# Altium schematic sheet HF_Amp.SchDoc
size 420 x 297 mm; Date: 28.01.2023; ApprovedBy: UA3REO; CheckedBy: UA3REO; Author: RU4PN; CompanyName: Wolf Team; DrawnBy: UA3REO; DocumentNumber: Wolf2 - HF Amp - Amp; SheetNumber: 2; SheetTotal: 3
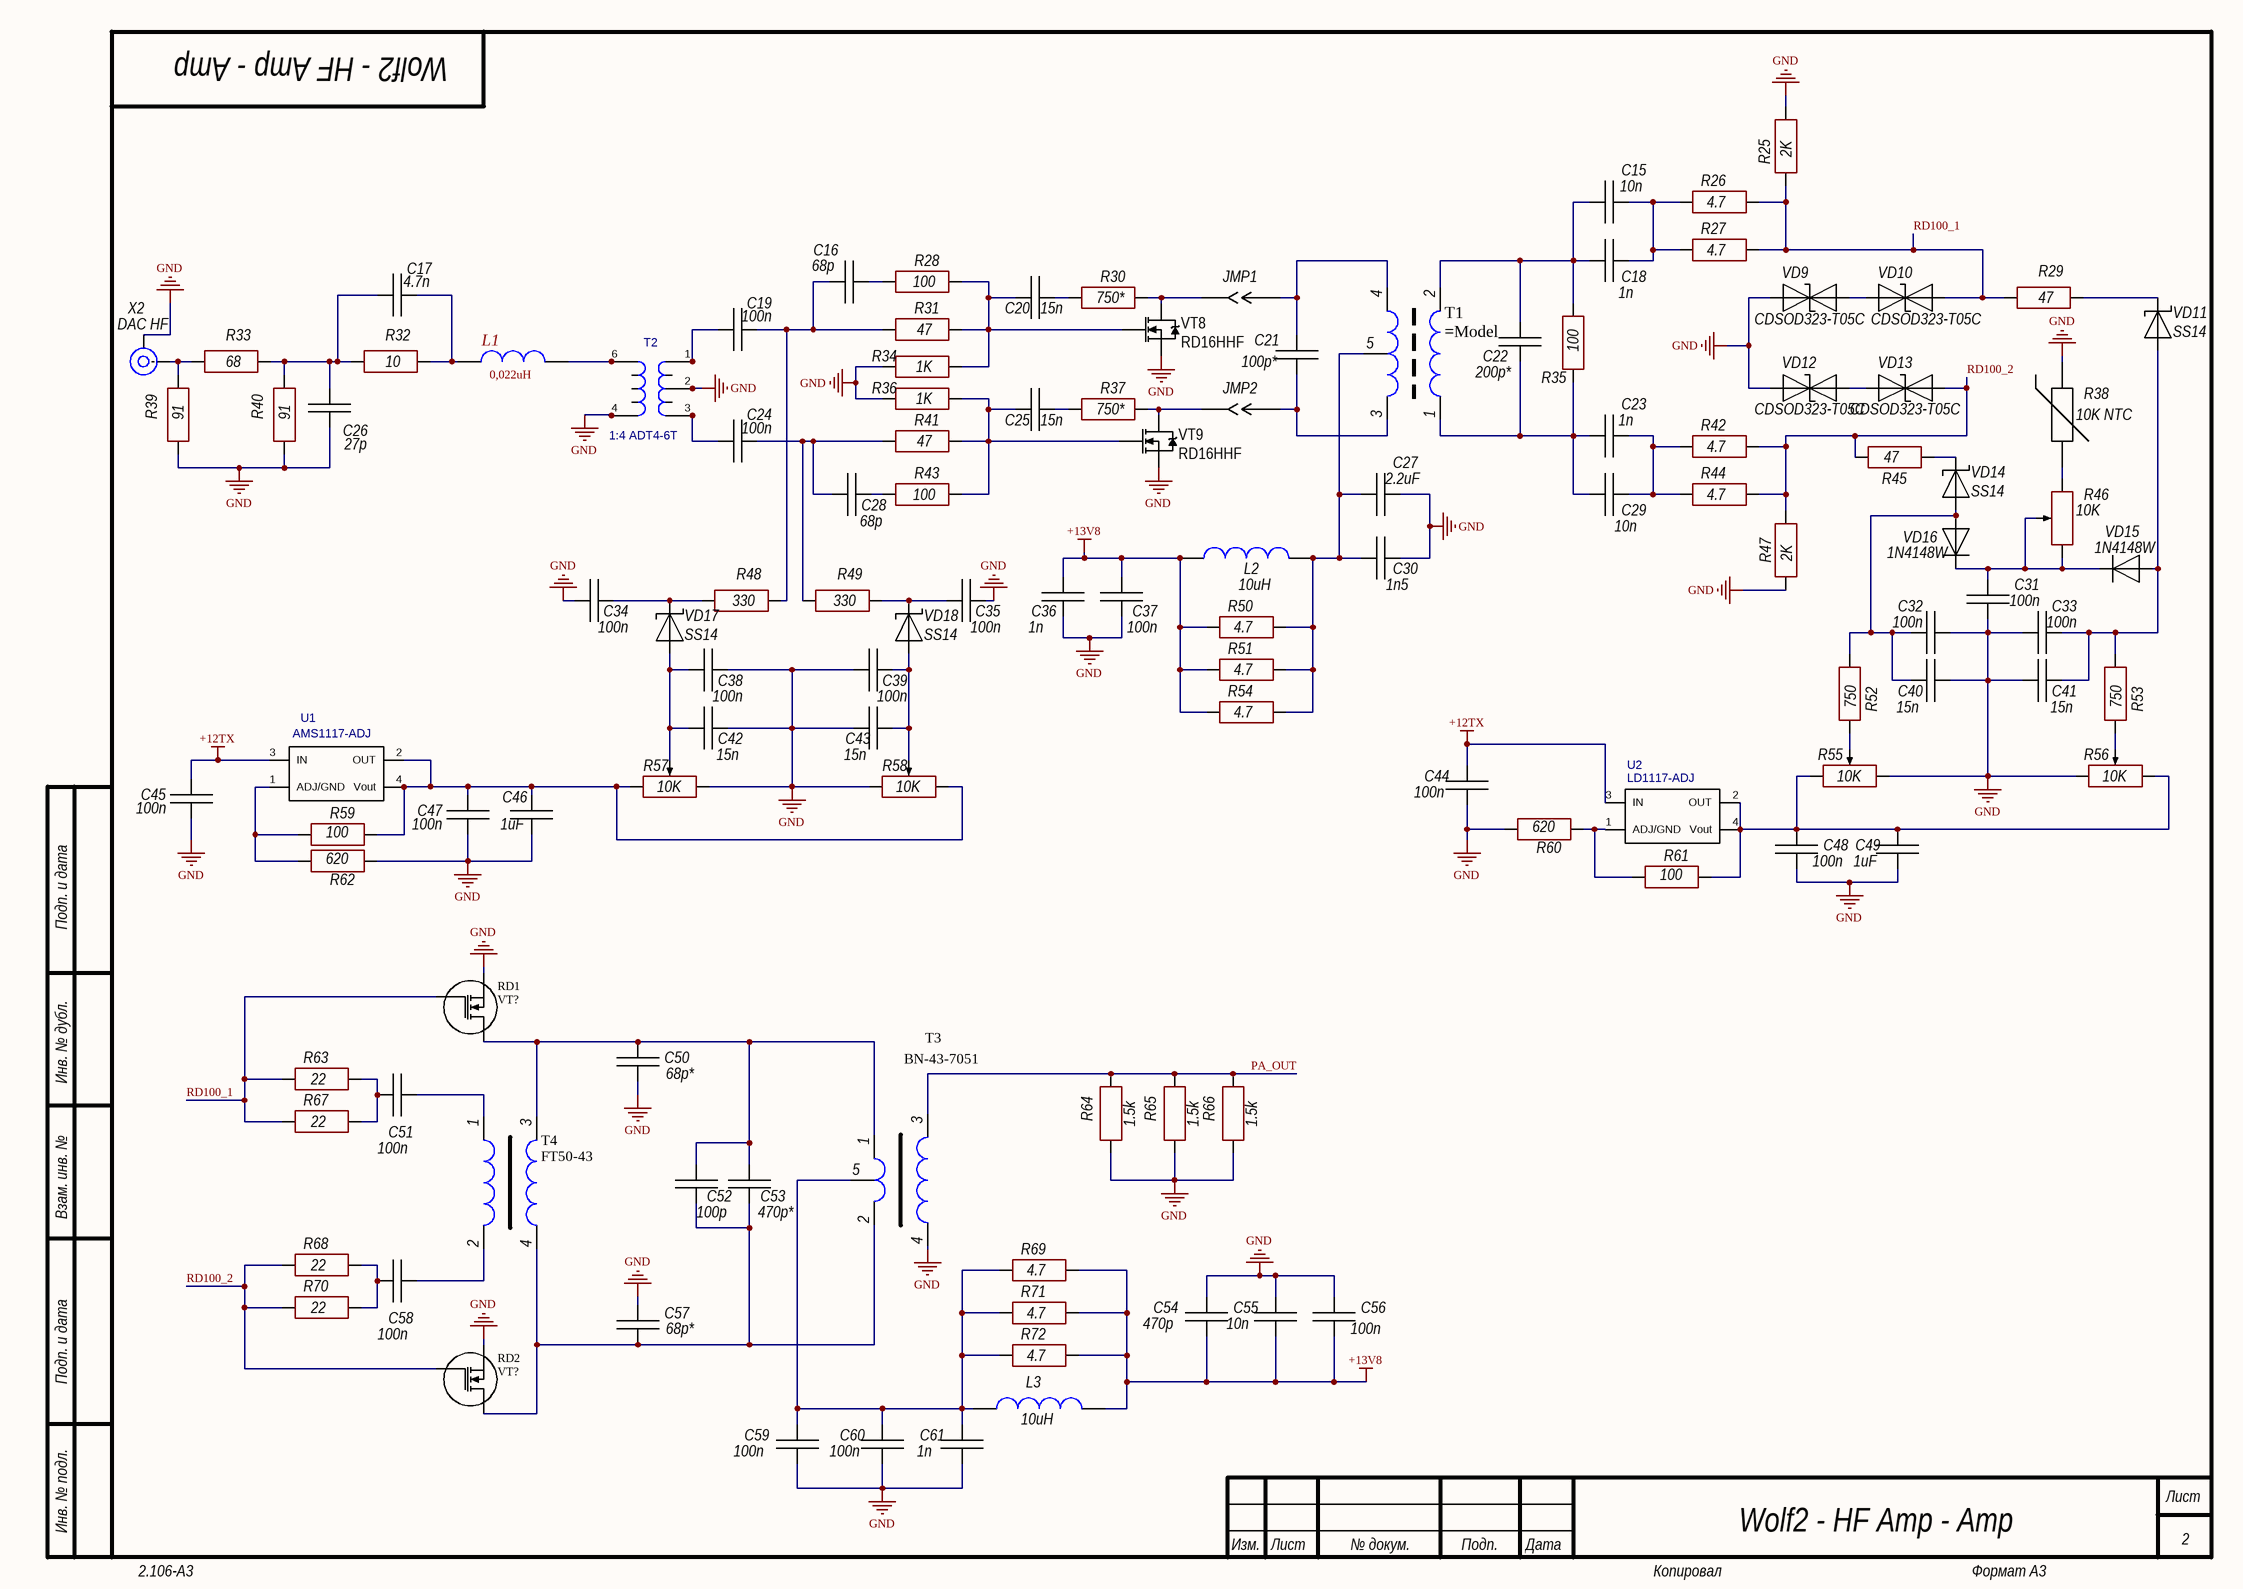
[diagram p0: HF_Amp.SchDoc]

## Parts
C15  10n  [CH1210C]
C16  68p  [CH0805C]
C17  4.7n  [CH0805C]
C18  1n  [CH1210C]
C19  100n  [CH0805C]
C20  15n  [CH1206C]
C21  100p*  [CH1210C]
C22  200p*  [CH1812C]
C23  1n  [CH1210C]
C24  100n  [CH0805C]
C25  15n  [CH1206C]
C26  27p  [CH0805C]
C27  2.2uF  [CH1206C]
C28  68p  [CH0805C]
C29  10n  [CH1210C]
C30  1n5  [CH1206C]
C31  100n  [CH0805C]
C32  100n  [CH0805C]
C33  100n  [CH0805C]
C34  100n  [CH0805C]
C35  100n  [CH0805C]
C36  1n  [CH0805C]
C37  100n  [CH0805C]
C38  100n  [CH0805C]
C39  100n  [CH0805C]
C40  15n  [CH0805C]
C41  15n  [CH0805C]
C42  15n  [CH0805C]
C43  15n  [CH0805C]
C44  100n  [CH0805C]
C45  100n  [CH0805C]
C46  1uF  [CH0805C]
C47  100n  [CH0805C]
C48  100n  [CH0805C]
C49  1uF  [CH0805C]
C50  68p*  [CH1206ATC]
C51  100n  [CH1210C]
C52  100p  [CH1812C]
C53  470p*  [CH1812C]
C54  470p  [CH1206C]
C55  10n  [CH1206C]
C56  100n  [CH1206C]
C57  68p*  [CH1206ATC]
C58  100n  [CH1210C]
C59  100n  [CH1206C]
C60  100n  [CH1206C]
C61  1n  [CH1206C]
JMP1  Jumper_2  [CON: JUMPER_2]  (value not drawn)
JMP2  Jumper_2  [CON: JUMPER_2]  (value not drawn)
L1  0,022uH  [CH1210L]
L2  10uH  [IND: R24]
L3  10uH  [IND: R24]
R25  2K  [CH2512R]
R26  4.7  [CH2512R]
R27  4.7  [CH2512R]
R28  100  [CH0805R]
R29  47  [CH0805R]
R30  750*  [CH1206R]
R31  47  [CH0805R]
R32  10  [CH0805R]
R33  68  [CH0805R]
R34  1K  [CH0805R]
R35  100  [CH2512R]
R36  1K  [CH0805R]
R37  750*  [CH1206R]
R38  10K NTC  [CON: PBS-2]
R39  91  [CH0805R]
R40  91  [CH0805R]
R41  47  [CH0805R]
R42  4.7  [CH2512R]
R43  100  [CH0805R]
R44  4.7  [CH2512R]
R45  47  [CH0805R]
R46  10K  [RES: 3296W]
R47  2K  [CH2512R]
R48  330  [CH0805R]
R49  330  [CH0805R]
R50  4.7  [CH2512R]
R51  4.7  [CH2512R]
R52  750  [CH0805R]
R53  750  [CH0805R]
R54  4.7  [CH2512R]
R55  10K  [RES: 3296W]
R56  10K  [RES: 3296W]
R57  10K  [RES: 3296W]
R58  10K  [RES: 3296W]
R59  100  [CH0805R]
R60  620  [CH0805R]
R61  100  [CH0805R]
R62  620  [CH0805R]
R63  22  [CH2512R]
R64  1.5k  [R-DIP]
R65  1.5k  [R-DIP]
R66  1.5k  [R-DIP]
R67  22  [CH2512R]
R68  22  [CH2512R]
R69  4.7  [CH2512R]
R70  22  [CH2512R]
R71  4.7  [CH2512R]
R72  4.7  [CH2512R]
RD1  VT?  [RD100]
RD2  VT?  [RD100]
T1  (no value)  [BN43-202-RD16]
T2  1:4 ADT4-6T  [TRANSF_ACORE2]
T3  BN-43-7051  [BN61-002-V1]
T4  FT50-43  [TRANS OS W2]
U1  value AMS1117-ADJ  [LT1117CST-3.3]  (hidden comment: 1117-ADJ)
U2  value LD1117-ADJ  [LT1117CST-3.3_2]  (hidden comment: 1117-ADJ)
VD9  CDSOD323-T05C  [SOD323]
VD10  CDSOD323-T05C  [SOD323]
VD11  SS14  [SMA]
VD12  CDSOD323-T05C  [SOD323]
VD13  CDSOD323-T05C  [SOD323]
VD14  SS14  [SMA]
VD15  1N4148W  [SOD123]
VD16  1N4148W  [SOD123]
VD17  SS14  [SMA]
VD18  SS14  [SMA]
VT8  PartNumber: RD16HHF  [rd16]
VT9  PartNumber: RD16HHF  [rd16]
X2  DAC HF  [CON: SMA]

## Nets
+12TX: C44.1 C45.1 U1.3(IN) U2.3(IN)
+13V8: C36.1 C37.1 C54.1 C55.1 C56.1 L2.2 L3.1 R50.2 R51.2 R54.2 R69.1 R71.1 R72.1
GND: C26.1 C27.2 C30.2 C31.2 C32.1 C33.2 C34.2 C35.1 C36.2 C37.2 C38.1 C39.2 C40.1 C41.2 C42.1 C43.2 C44.2 C45.2 C46.2 C47.2 C48.2 C49.2 C50.1 C54.2 C55.2 C56.2 C57.2 C59.1 C60.1 C61.1 R25.1 R34.2 R36.2 R38.2 R39.2 R40.2 R47.2 R55.3 R56.1 R57.3 R58.1 R60.2 R62.1 R64.1 R65.1 R66.1 RD1.2(S) RD2.2(S) T2.2(S2) T2.4(P1) T2.8 T2.11 T3.4 VD9.1(A) VD12.1(A) VT8.2(S) VT9.2(S) X2.2(IN)
PA_OUT: R64.2 R65.2 R66.2 T3.3
RD100_1: R25.2 R26.1 R27.1 R29.2 R63.2 R67.2 RD1.3(G) VD10.2(C)
RD100_2: R42.1 R44.1 R45.1 R47.1 R68.2 R70.2 RD2.3(G) VD13.2(C)
NetC15_1: C15.1 C18.1 C22.1 R35.1 T1.2
NetC15_2: C15.2 C18.2 R26.2 R27.2
NetC16_1: C16.1 R28.2
NetC16_2: C16.2 C19.2 R31.2 R48.1
NetC17_1: C17.1 C26.2 R32.2 R33.1 R40.1
NetC17_2: C17.2 L1.2 R32.1
NetC19_1: C19.1 T2.1(S3) T2.7
NetC20_1: C20.1 R30.2
NetC20_2: C20.2 R28.1 R31.1 R34.1 VT8.1(G)
NetC21_1: C21.1 JMP1.2(OUT) T1.4
NetC21_2: C21.2 JMP2.2(OUT) T1.3
NetC22_2: C22.2 C23.1 C29.1 R35.2 T1.1
NetC23_2: C23.2 C29.2 R42.2 R44.2
NetC24_1: C24.1 T2.3(S1) T2.9
NetC24_2: C24.2 C28.2 R41.2 R49.2
NetC25_1: C25.1 R37.2
NetC25_2: C25.2 R36.1 R41.1 R43.1 VT9.1(G)
NetC27_1: C27.1 C30.1 L2.1 R50.1 R51.1 R54.1 T1.5
NetC28_1: C28.1 R43.2
NetC31_1: C31.1 R46.1 R46.2 VD15.2 VD16.2
NetC32_2: C32.2 C40.2 R52.1 VD14.1 VD16.1
NetC33_1: C33.1 C41.1 R53.1 VD11.1 VD15.1
NetC34_1: C34.1 R48.2 VD17.2
NetC35_2: C35.2 R49.1 VD18.2
NetC38_2: C38.2 C42.2 R57.2 VD17.1
NetC39_1: C39.1 C43.1 R58.2 VD18.1
NetC46_1: C46.1 C47.1 R57.1 R58.3 R59.1 U1.2(OUT) U1.4(Vout)
NetC48_1: C48.1 C49.1 R55.1 R56.3 R61.1 U2.2(OUT) U2.4(Vout)
NetC50_2: C50.2 C52.2 C53.2 RD1.1(D) T3.1 T4.3
NetC51_1: C51.1 R63.1 R67.1
NetC51_2: C51.2 T4.1
NetC52_1: C52.1 C53.1 C57.1 RD2.1(D) T3.2 T4.4
NetC58_1: C58.1 R68.1 R70.1
NetC58_2: C58.2 T4.2
NetC59_2: C59.2 C60.2 C61.2 L3.2 R69.2 R71.2 R72.2 T3.5
NetJMP1_1: JMP1.1(IN) R30.1 VT8.3(D)
NetJMP2_1: JMP2.1(IN) R37.1 VT9.3(D)
NetL1_1: L1.1 T2.6(P2) T2.10
NetR29_1: R29.1 VD11.2
NetR33_2: R33.2 R39.1 X2.1(IN)
NetR38_1: R38.1 R46.3
NetR45_2: R45.2 VD14.2
NetR52_2: R52.2 R55.2
NetR53_2: R53.2 R56.2
NetR59_2: R59.2 R62.2 U1.1(ADJ/GND)
NetR60_1: R60.1 R61.2 U2.1(ADJ/GND)
NetVD9_2: VD9.2(C) VD10.1(A)
NetVD12_2: VD12.2(C) VD13.1(A)

## Notes on the sheet
- Подп. и дата
- Инв. № дубл.
- Взам. инв. №
- Инв. № подл.
- Изм.
- Лист
- № докум.
- Подп.
- Дата
- 2.106-A3
- Копировал
- Формат А3

## Library data of the parts
C15-C61 = Capacitor: Manufacturer: *; Model: *; HelpURL: *; ComponentKind: *; Value: *
JMP1 JMP2 = Jumper_2: Jumper
L1 = Inductor-2
L2 L3 = Inductor ring: Value: {Value}; Model: *; ComponentKind: *; Manufacturer: *; HelpURL: *
R25-R37 R39-R45 R47-R54 R59-R72 = Resistor: Manufacturer: *; Model: *; HelpURL: *; ComponentKind: *; Value: *
R38 = NTC: Manufacturer: *; Model: *; HelpURL: *; ComponentKind: *; Value: *
R46 R55-R58 = ADJ resistor: Manufacturer: *; Model: *; HelpURL: *; ComponentKind: *; Value: *
RD1 = N-1
RD2 = N-1: RD100
T1 = TRANS-RD16
T2 = TRANSF_ACORE2: Transformer; Value: 1:4 ADT4-6T
T3 = BN-43-7051_1
T4 = Trans_L
U1 U2 = LT1117CST-3.3: LT1117CST-ADJ
VD9 VD10 VD12 VD13 = TVS-diod: ComponentKind: *; Manufacturer: *; Model: *; HelpURL: *
VD11 VD14 VD17 VD18 = Diod Schottky: ComponentKind: *; Manufacturer: *; Model: *; HelpURL: *
VD15 VD16 = Diod: ComponentKind: *; Manufacturer: *; Model: *; HelpURL: *
VT8 VT9 = MOSFET_N_132: Manufacturer: Infineon Technologies; ValueManufacturerPartNumber: MOSFET N-channel transistor, 80V, 7A, 9.1nC, 2.5W, 34mOhm, 756pF, 8-TDSON, -55...+150°C; TypeTransistor: MOSFET N-channel transistor; VoltageDS: 80V; CurrentDS: 7A; RDS: 34mOhm; GateCharge: 9.1nC; InputCapacitor: 756pF; MaxPower: 2.5W; Package: 8-TDSON; HelpURL: https://www.digikey.com/product-detail/en/infineon-technologies/BSC340N08NS3GATMA1/BSC340N08NS3GATMA1TR-ND/2080655; Temperature: -55...+150°C
X2 = SMA: RF; Model: *; Manufacturer: *; HelpURL: *; ComponentKind: *